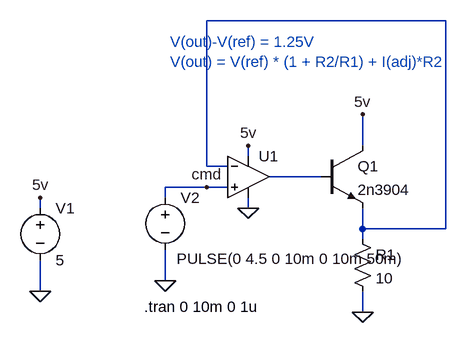
[diagram p0: schematic npn_output_sim.asc]
npn_output_sim.asc, the LTspice schematic file:
Version 4
SHEET 1 880 1124
WIRE 432 -48 64 -48
WIRE 304 144 304 96
WIRE 128 160 128 144
WIRE 64 176 64 -48
WIRE 96 176 64 176
WIRE 240 192 160 192
WIRE 64 208 0 208
WIRE 96 208 64 208
WIRE 0 224 0 208
WIRE -192 240 -192 224
WIRE 128 240 128 224
WIRE 304 272 304 240
WIRE 432 272 432 -48
WIRE 432 272 304 272
WIRE 304 288 304 272
WIRE 0 352 0 304
WIRE -192 368 -192 320
WIRE 304 400 304 368
FLAG -192 368 0
FLAG 0 352 0
FLAG 64 208 cmd
FLAG 128 144 5v
FLAG 128 240 0
FLAG 304 400 0
FLAG 304 96 5v
FLAG -192 224 5v
SYMBOL voltage -192 224 R0
SYMATTR InstName V1
SYMATTR Value 5
SYMBOL voltage 0 208 R0
WINDOW 3 18 110 Left 2
WINDOW 123 0 0 Left 0
WINDOW 39 0 0 Left 0
SYMATTR Value PULSE(0 4.5 0 10m 0 10m 50m)
SYMATTR InstName V2
SYMBOL OpAmps\\UniversalOpAmp2 128 192 R0
SYMATTR InstName U1
SYMBOL npn 240 144 R0
SYMATTR InstName Q1
SYMATTR Value 2n3904
SYMBOL res 288 272 R0
SYMATTR InstName R1
SYMATTR Value 10
TEXT -32 392 Left 2 !.tran 0 10m 0 1u
TEXT 8 -16 Left 2 ;V(out)-V(ref) = 1.25V\nV(out) = V(ref) * (1 + R2/R1) + I(adj)*R2

The netlist it stands for:
* npn_output_sim.asc
V1 5v 0 5
V2 cmd 0 PULSE(0 4.5 0 10m 0 10m 50m)
XU1 cmd N001 5v 0 N002 level2 Avol=1Meg GBW=10Meg Slew=10Meg Ilimit=25m Rail=0 Vos=0 En=0 Enk=0 In=0 Ink=0 Rin=500Meg  ; pins In+ In- V+ V- OUT
Q1 5v N002 N001 0 2n3904
R1 N001 0 10
.model NPN NPN
.model PNP PNP
.lib standard.bjt
.tran 0 10m 0 1u
* V(out)-V(ref) = 1.25V
* V(out) = V(ref) * (1 + R2/R1) + I(adj)*R2
.lib UniversalOpAmp2.lib
.backanno
.end